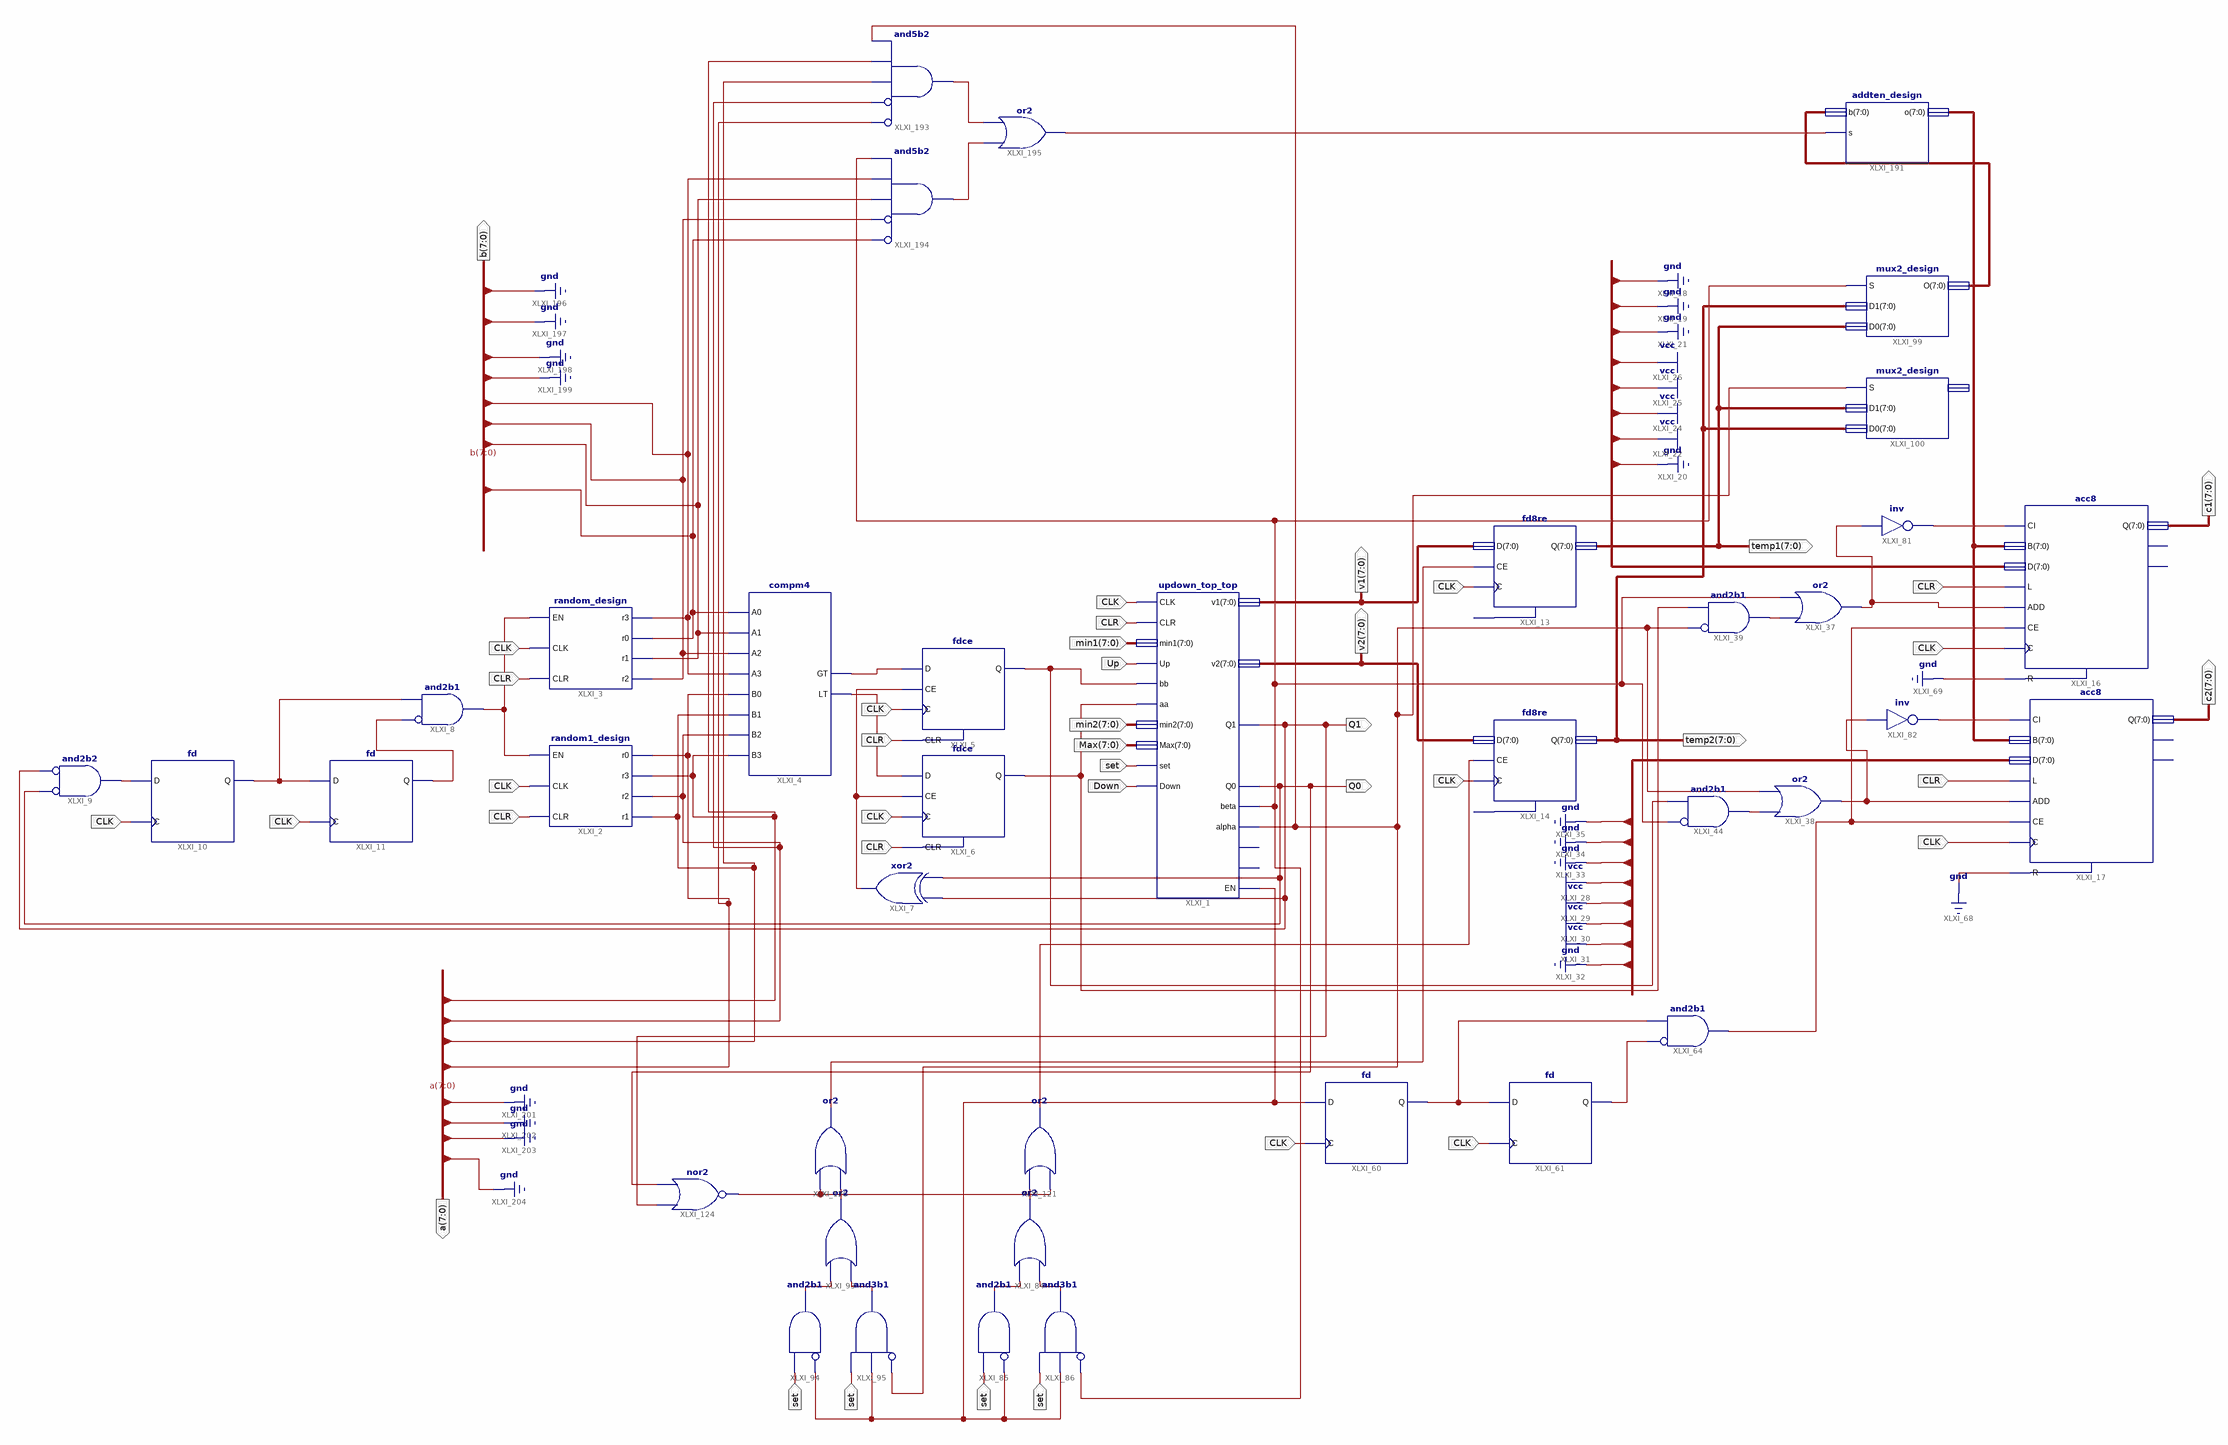
[diagram p0: schematic sheet 1]
// Xilinx ISE schematic indianpoker_top.sch (spartan3) as structural Verilog: 39 symbols, 18 ports
module indianpoker_top (
  input  CLK,
  input  [7:0] Max,
  input  set,
  input  CLR,
  input  [7:0] min1,
  input  [7:0] min2,
  input  Up,
  input  Down,
  output Q1,
  output Q0,
  output [7:0] v2,
  output [7:0] v1,
  output [7:0] c2,
  output [7:0] c1,
  output [7:0] temp1,
  output [7:0] temp2,
  output [7:0] b,
  output [7:0] a
);

  wire XLXN_9, XLXN_10, XLXN_11, XLXN_12, XLXN_14, XLXN_18, XLXN_35, XLXN_36, XLXN_37, XLXN_113, XLXN_128,
       XLXN_167, XLXN_168, XLXN_170, XLXN_205, XLXN_206, XLXN_207, XLXN_208, XLXN_209, XLXN_217, XLXN_218,
       XLXN_219, XLXN_222, XLXN_225, XLXN_226, XLXN_283, XLXN_284, XLXN_291, XLXN_364, XLXN_365, XLXN_366,
       XLXN_367, XLXN_368;
  wire [7:0] ten, XLXN_369;

  updown_top_top XLXI_1 (
    .CLK(CLK), .CLR(CLR), .min1(min1), .Up(Up), .bb(XLXN_11), .aa(XLXN_12), .min2(min2), .Max(Max),
    .set(set), .Down(Down), .v1(v1), .v2(v2), .Q1(Q1), .Q0(Q0), .beta(XLXN_364), .alpha(XLXN_365),
    .EN(XLXN_219));  // open: b, a
  random1_design XLXI_2 (.EN(XLXN_37), .CLK(CLK), .CLR(CLR), .r0(a[0]), .r3(a[3]), .r2(a[2]), .r1(a[1]));
  random_design XLXI_3 (.EN(XLXN_37), .CLK(CLK), .CLR(CLR), .r3(b[3]), .r0(b[0]), .r1(b[1]), .r2(b[2]));
  compm4 XLXI_4 (
    .A0(b[0]), .A1(b[1]), .A2(b[2]), .A3(b[3]), .B0(a[0]), .B1(a[1]), .B2(a[2]), .B3(a[3]), .GT(XLXN_9),
    .LT(XLXN_10));
  fdce XLXI_5 (.C(CLK), .CE(XLXN_14), .CLR(CLR), .D(XLXN_9), .Q(XLXN_11));
  fdce XLXI_6 (.C(CLK), .CE(XLXN_14), .CLR(CLR), .D(XLXN_10), .Q(XLXN_12));
  xor XLXI_7 (XLXN_14, Q1, Q0);
  and XLXI_8 (XLXN_37, ~XLXN_35, XLXN_36);  // and2b1
  fd XLXI_10 (.C(CLK), .D(XLXN_18), .Q(XLXN_36));
  fd XLXI_11 (.C(CLK), .D(XLXN_36), .Q(XLXN_35));
  and XLXI_9 (XLXN_18, ~Q0, ~Q1);  // and2b2
  fd8re XLXI_13 (.C(CLK), .CE(XLXN_222), .D(v1), .Q(temp1));  // open: R
  fd8re XLXI_14 (.C(CLK), .CE(XLXN_209), .D(v2), .Q(temp2));  // open: R
  or XLXI_38 (XLXN_208, XLXN_128, XLXN_365);
  and XLXI_44 (XLXN_128, ~XLXN_364, XLXN_11);  // and2b1
  fd XLXI_60 (.C(CLK), .D(XLXN_219), .Q(XLXN_168));
  fd XLXI_61 (.C(CLK), .D(XLXN_168), .Q(XLXN_167));
  and XLXI_64 (XLXN_170, ~XLXN_167, XLXN_168);  // and2b1
  or XLXI_37 (XLXN_206, XLXN_113, XLXN_364);
  and XLXI_39 (XLXN_113, ~XLXN_365, XLXN_12);  // and2b1
  acc8 XLXI_17 (
    .ADD(XLXN_208), .B(ten), .C(CLK), .CE(XLXN_170), .CI(XLXN_207), .D(8'b00011110), .L(CLR), .R(1'b0), .Q(c2));  // open: CO, OFL
  acc8 XLXI_16 (
    .ADD(XLXN_206), .B(ten), .C(CLK), .CE(XLXN_170), .CI(XLXN_205), .D(8'b00011110), .L(CLR), .R(1'b0), .Q(c1));  // open: CO, OFL
  not XLXI_81 (XLXN_205, XLXN_206);
  not XLXI_82 (XLXN_207, XLXN_208);
  mux2_design XLXI_100 (.S(XLXN_365), .D1(temp1), .D0(temp2));  // open: O
  mux2_design XLXI_99 (.S(XLXN_364), .D1(temp2), .D0(temp1), .O(XLXN_369));
  and XLXI_94 (XLXN_225, ~XLXN_219, set);  // and2b1
  and XLXI_95 (XLXN_226, ~XLXN_365, XLXN_219, set);  // and3b1
  or XLXI_93 (XLXN_283, XLXN_226, XLXN_225);
  or XLXI_84 (XLXN_284, XLXN_218, XLXN_217);
  and XLXI_86 (XLXN_218, ~XLXN_364, XLXN_219, set);  // and3b1
  and XLXI_85 (XLXN_217, ~XLXN_219, set);  // and2b1
  or XLXI_120 (XLXN_222, XLXN_283, XLXN_291);
  or XLXI_121 (XLXN_209, XLXN_291, XLXN_284);
  nor XLXI_124 (XLXN_291, Q1, Q0);
  addten_design XLXI_191 (.b(XLXN_369), .s(XLXN_368), .o(ten));
  and XLXI_193 (XLXN_366, ~a[0], ~a[2], a[1], a[3], XLXN_365);  // and5b2
  and XLXI_194 (XLXN_367, ~b[0], ~b[2], b[1], b[3], XLXN_364);  // and5b2
  or XLXI_195 (XLXN_368, XLXN_367, XLXN_366);

  assign a[7:4] = 4'b0000;
  assign b[7:4] = 4'b0000;
endmodule
